# Altium schematic sheet Sheet.SchDoc
size A3
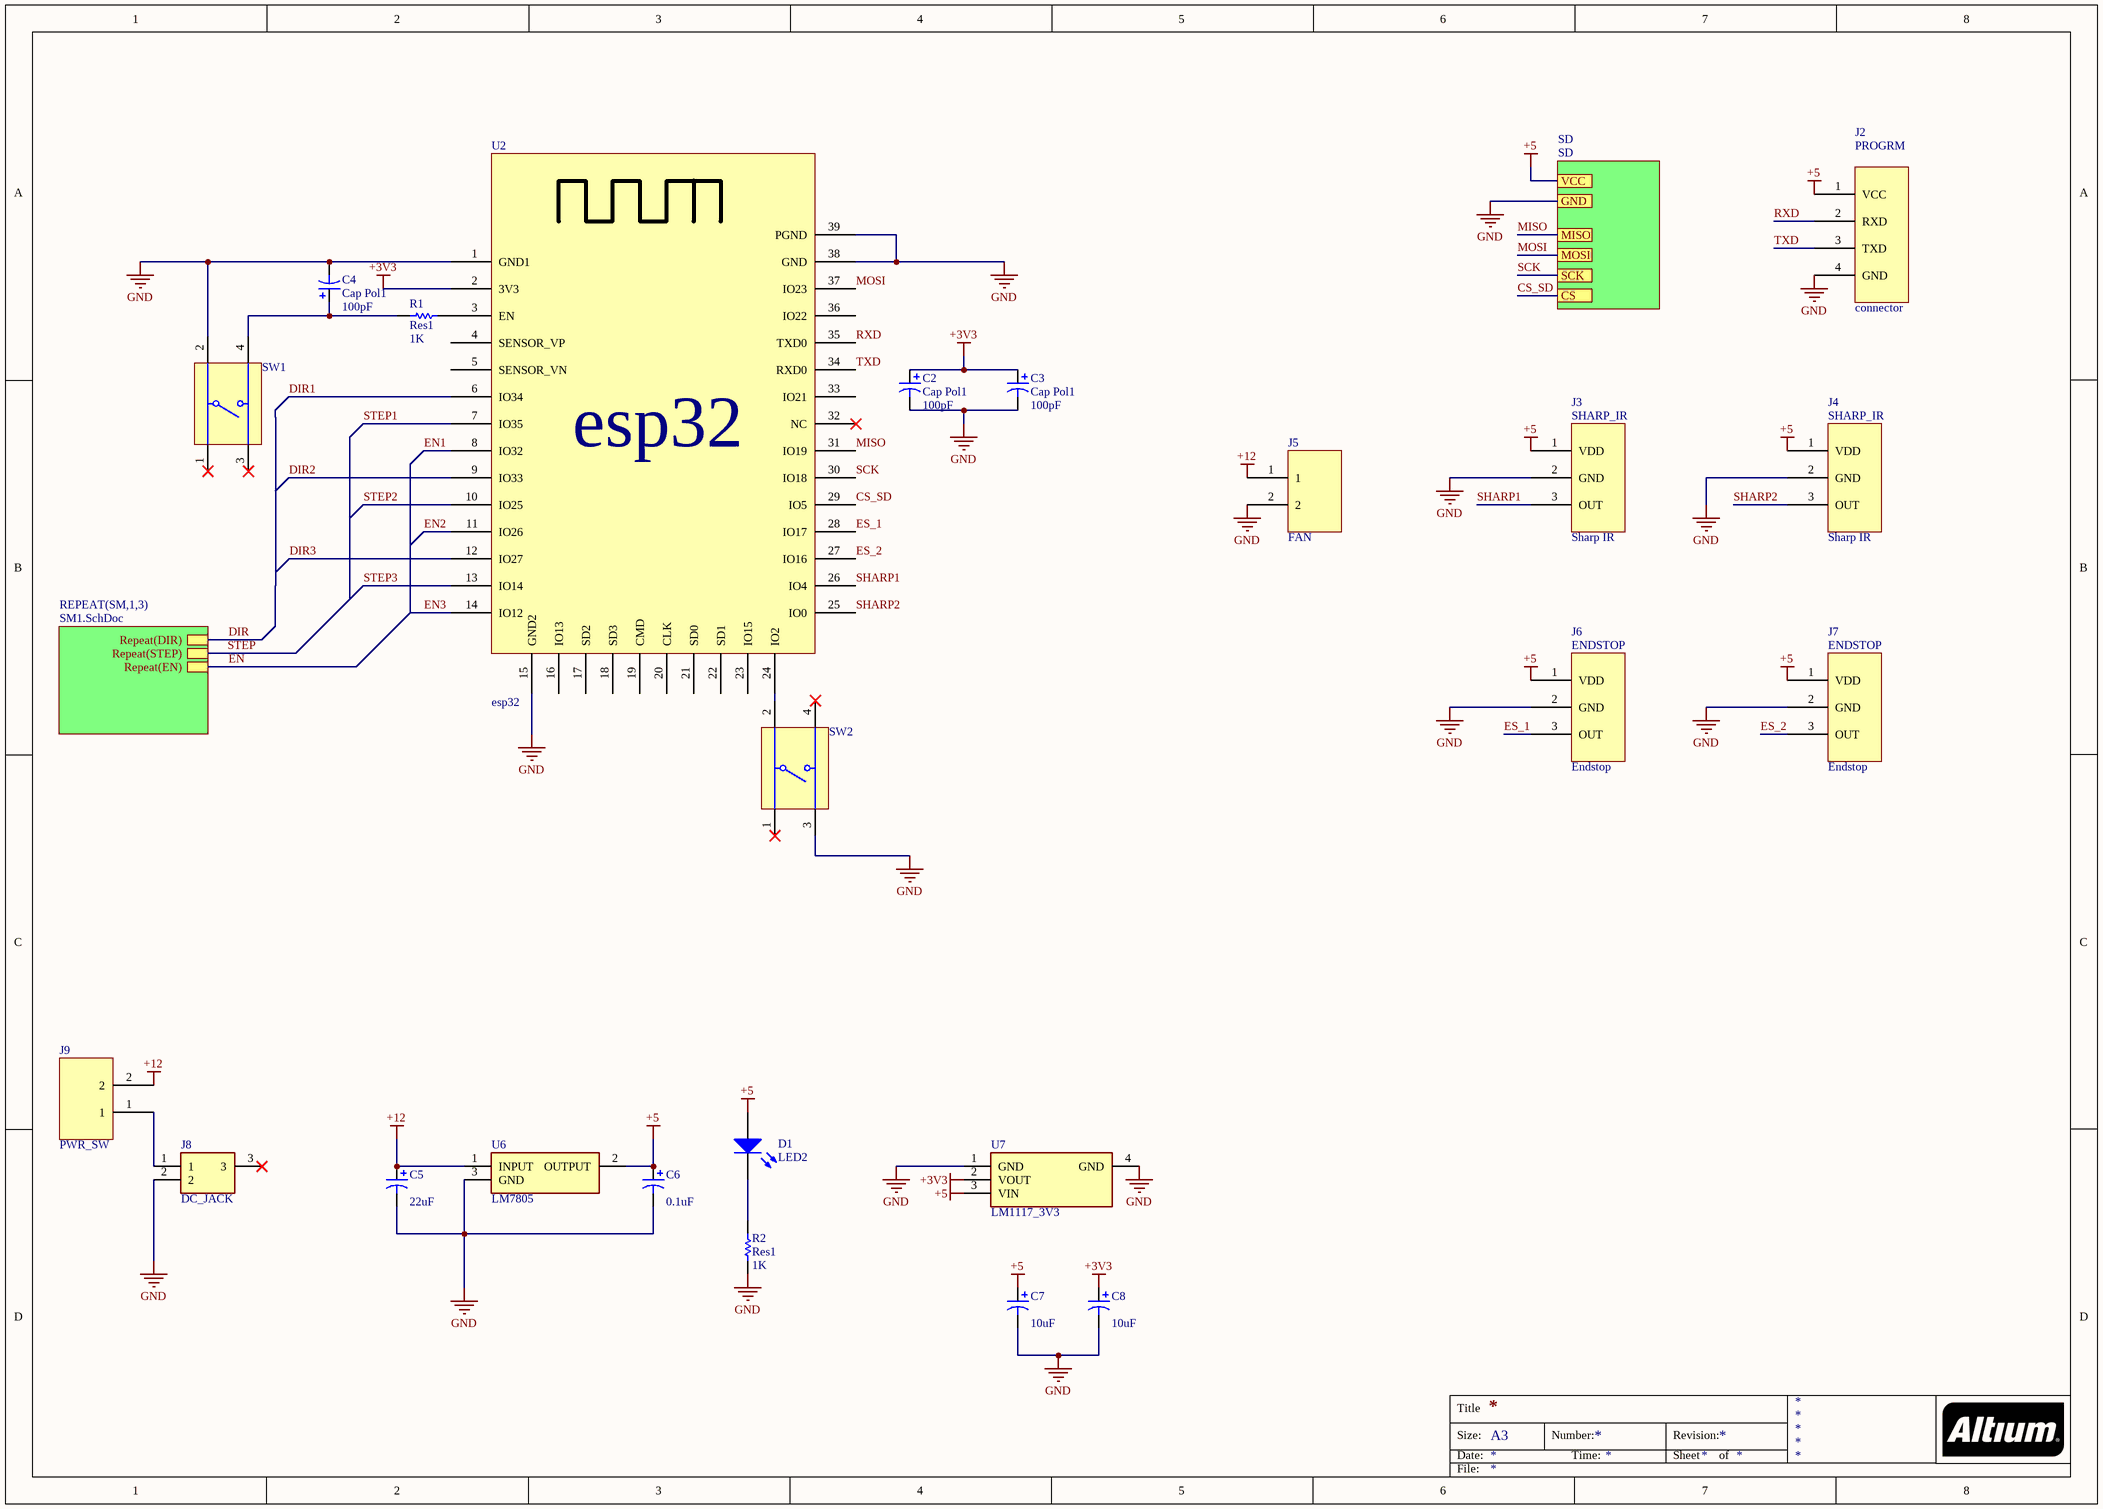
[diagram p0: Sheet.SchDoc]

## Parts
C2  Cap Pol1  value 100pF  [6-0805_N]
C3  Cap Pol1  value 100pF  [6-0805_N]
C4  Cap Pol1  value 100pF  [6-0805_N]
C5  value 22uF  [6-0805_N]  (hidden comment: Cap Pol1)
C6  value 0.1uF  [6-0805_N]  (hidden comment: Cap Pol1)
C7  value 10uF  [6-0805_N]  (hidden comment: Cap Pol1)
C8  value 10uF  [6-0805_N]  (hidden comment: Cap Pol1)
D1  LED2  [3.2X1.6X1.1]
J2  connector  [TTL]
J3  Sharp IR  [SHARP_IR]
J4  Sharp IR  [SHARP_IR]
J5  FAN  [JST_2P]
J6  Endstop  [ENDSTOP]
J7  Endstop  [ENDSTOP]
J8  DC_JACK  [DC_JACK]
J9  PWR_SW  [JST_2P]
R1  Res1  value 1K  [6-0805_N]
R2  Res1  value 1K  [6-0805_N]
SW1  1825910-6  [TECO-1825910-6_V]  (value not drawn)
SW2  1825910-6  [TECO-1825910-6_V]  (value not drawn)
U2  esp32  [ESP_SoC_Module]
U6  LM7805  [LM7805]
U7  LM1117_3V3  [LM1117_3V3]

## Sub-sheets
REPEAT(SM,1,3) = SM1.SchDoc: Repeat(DIR), Repeat(STEP), Repeat(EN)
SD = SD: no entries

## Ports
CS, GND, MISO, MOSI, SCK, VCC

## Nets
+3V3: C2.1 C3.1 C8.1 U2.2(3V3) U7.2(VOUT)
+5: C6.1 C7.1 D1.1(A) J2.1(VCC) J3.1(VDD) J4.1(VDD) J6.1(VDD) J7.1(VDD) U6.2(OUTPUT) U7.3(VIN) ; port VCC
+12: C5.1 J5.1 J9.2 U6.1(INPUT)
GND: C2.2 C3.2 C4.2 C5.2 C6.2 C7.2 C8.2 J2.4(GND) J3.2(GND) J4.2(GND) J5.2 J6.2(GND) J7.2(GND) J8.2 R2.1 SW1.2 SW2.3 U2.1(GND1) U2.15(GND2) U2.38(GND) U2.39(PGND) U6.3(GND) U7.1(GND) U7.4(GND) ; port GND
CS_SD: U2.29(IO5) ; port CS
DIR: sheet REPEAT(SM,1,3)/Repeat(DIR)
DIR1: U2.6(IO34)
DIR2: U2.9(IO33)
DIR3: U2.12(IO27)
EN: sheet REPEAT(SM,1,3)/Repeat(EN)
EN1: U2.8(IO32)
EN2: U2.11(IO26)
EN3: U2.14(IO12)
ES_1: J6.3(OUT) U2.28(IO17)
ES_2: J7.3(OUT) U2.27(IO16)
MISO: U2.31(IO19) ; port MISO
MOSI: U2.37(IO23) ; port MOSI
RXD: J2.2(RXD) U2.35(TXD0)
SCK: U2.30(IO18) ; port SCK
SHARP1: J3.3(OUT) U2.26(IO4)
SHARP2: J4.3(OUT) U2.25(IO0)
STEP: sheet REPEAT(SM,1,3)/Repeat(STEP)
STEP1: U2.7(IO35)
STEP2: U2.10(IO25)
STEP3: U2.13(IO14)
TXD: J2.3(TXD) U2.34(RXD0)
NetC4_1: C4.1 R1.1 SW1.4
NetD1_2: D1.2(K) R2.2
NetJ8_1: J8.1 J9.1
NetR1_2: R1.2 U2.3(EN)
NetSW2_2: SW2.2 U2.24(IO2)

Not connected (* = marked no-connect by the designer): J8 3*; SW1 1* 3*; SW2 1* 4*; U2 4(SENSOR_VP) 5(SENSOR_VN) 16(IO13) 17(SD2) 18(SD3) 19(CMD) 20(CLK) 21(SD0) 22(SD1) 23(IO15) 32(NC)* 33(IO21) 36(IO22)

## Notes on the sheet
- Title
- Size:
- Date:
- A3
- Number:
- Time:
- Revision:
- Sheet
- of
- File:
- (in symbol TTL) PROGRM

## Library data of the parts
C2-C8 = Cap Pol1: Polarized Capacitor (Radial); Published: 8-Jun-2000; LatestRevisionDate: 17-Jul-2002; LatestRevisionNote: Re-released for DXP Platform.; PackageReference: RB7.6-15; Publisher: Altium Limited; PackageDescription: Polarized Capacitor (Radial); 2 Leads
D1 = LED2: Typical RED, GREEN, YELLOW, AMBER GaAs LED; Published: 8-Jun-2000; LatestRevisionDate: 17-Jul-2002; LatestRevisionNote: Re-released for DXP Platform.; PackageVersion: Feb-2002; PackageReference: 3.2X1.6X1.1; Publisher: Altium Limited; PackageDescription: SM LED; 2 Flat Leads
J2 = TTL
J3 J4 = SHARP_IR
J5 J9 = JST_2P
R1 R2 = Res1: Resistor; Published: 8-Jun-2000; LatestRevisionDate: 17-Jul-2002; LatestRevisionNote: Re-released for DXP Platform.; PackageReference: AXIAL-0.3; Publisher: Altium Limited; PackageDescription: Axial Device, Thru-Hole; 2 Leads; 0.3 in Pin Spacing
SW1 SW2 = CMP-1684-00021-1: Tact Switch, SPST-NO, 0.05 A, -35 to 85 degC, 4-Pin THD, RoHS, Bulk; Manufacturer: TE Connectivity; Maximum Contact Resistance: 100mOhm; Mechanical Life: 100000Cycles; Bushing Type: Unthreaded; Switch Configuration: OFF(ON); Maximum DC Voltage Rating: 24V; Contact Rating @ Voltage: 0.05A@24VDC; Actuator Color: Black; Body Orientation: Straight; Function: MomentaryContact; Illumination: N/R; Actuator Style: RoundButton; Actuator Material: PolybutyleneTerephthalate; Dielectric Strength: 500VAC; Pole Throw Configuration: SPST; Actuator Length: 1.4mm; Product Weight: N/A; Contact Material: CopperAlloy; Housing Material: N/A; Terminal Type: PCPins; Minimum Insulation Resistance: 100MOhm; Package Description: 4-Pin Through Hole Device, Body 5.99 x 5.99 mm, Pitch 6.5 mm; Part No: 1825910-6; Package Reference: THD; Base Material: N/A; Manufacturer URL: http://www.te.com; Contact Plating: Silver; RoHS: Yes; Datasheet Version: Rev. C9; Electrical Life: 100000Cycles; Maximum AC Voltage Rating: N/A; Thread Size: N/R; Operating Temperature: -35to85C; Mounting: ThroughHole; Dimension: 5.99x5mm; Datasheet URL: http://www.te.com/commerce/DocumentDelivery/DDEController?Action=showdoc&DocId=Customer+Drawing%7F1825910%7FC9%7Fpdf%7FEnglish%7FENG_CD_1825910_C9.pdf%7F1825910-6; Family: 1825910; Seal Location: N/A; Seal Description: N/A; Packaging: N/A
U2 = ESP_SoC_Module